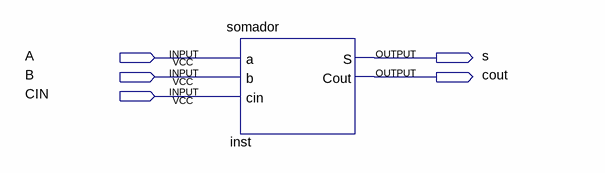
[diagram p0: schematic sheet]
// Quartus schematic Exp52.bdf as structural Verilog: 1 symbols, 5 pins
module Exp52 (
  input  A,
  input  B,
  input  CIN,
  output s,
  output cout
);

  somador inst (.a(A), .b(B), .cin(CIN), .S(s), .Cout(cout));
endmodule
